# Altium schematic sheet E17-15-POWER-DIST.SchDoc
size A; DocumentNumber: 5; SheetNumber: 5; SheetTotal: 9
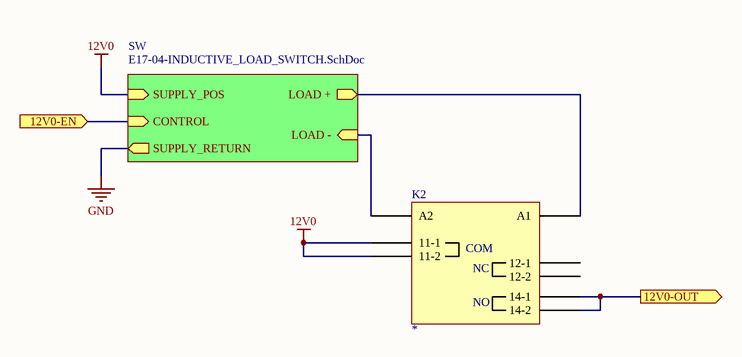
[diagram p0: E17-15-POWER-DIST.SchDoc]

## Parts
K2  *  [TE-7-1393243-5]

## Sub-sheets
SW = E17-04-INDUCTIVE_LOAD_SWITCH.SchDoc: CONTROL (in), LOAD + (out), SUPPLY_POS (in), LOAD - (in), SUPPLY_RETURN (out)

## Ports
12V0-EN (in), 12V0-OUT (out)

## Nets
12V0: K2.3(11-1) K2.6(11-2) ; sheet SW/SUPPLY_POS
GND: sheet SW/SUPPLY_RETURN
12V0-EN: port 12V0-EN, sheet SW/CONTROL
12V0-OUT: K2.4(14-1) K2.5(14-2) ; port 12V0-OUT
NetK2_1: K2.1(A2) ; sheet SW/LOAD -
NetK2_8: K2.8(A1) ; sheet SW/LOAD +

Not connected (* = marked no-connect by the designer): K2 2(12-1) 7(12-2)

## Notes on the sheet
- (in symbol TE-1393240-3) COM; NC; NO

## Library data of the parts
K2 = TE-1393240-3: RELAY GEN PURPOSE SPDT 16A 110V